# Altium schematic sheet PWM.SchDoc
size A4; SheetNumber: 5; SheetTotal: 5
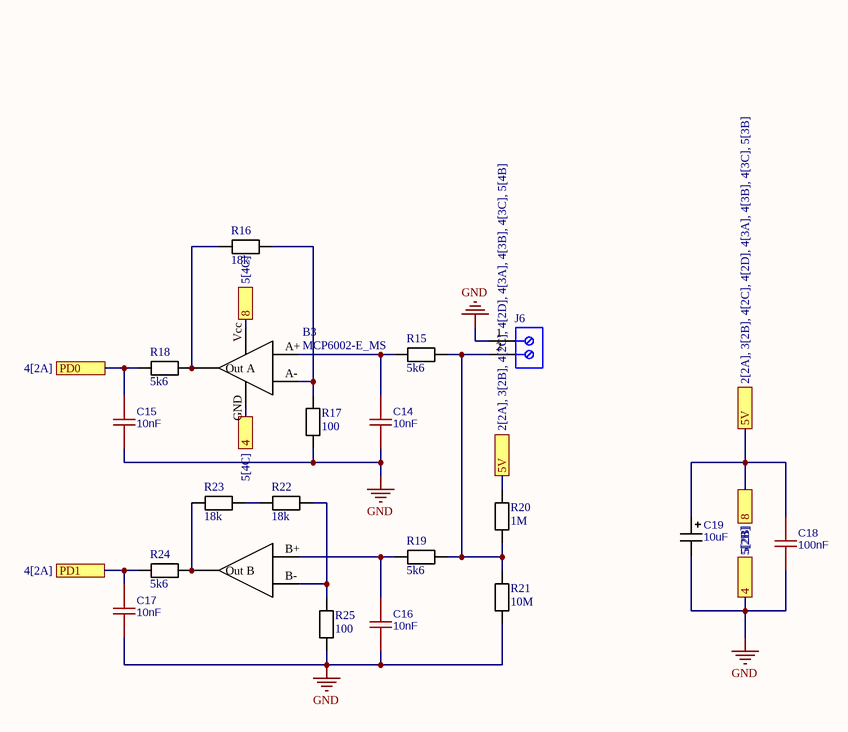
[diagram p0: PWM.SchDoc]

## Parts
B3  MCP6002-E_MS  [MCP6002-E_MS]
C14  10nF  [10nf]
C15  10nF  [10nf]
C16  10nF  [10nF]
C17  10nF  [10nF]
C18  100nF  [10nf]
C19  10uF  [10uf]
J6  691214110002  [2 Screw Terminal WE 691214110002]  (value not drawn)
R15  5k6  [R0805]
R16  18k  [R0805]
R17  100  [R0805]
R18  5k6  [R0805]
R19  5k6  [R0805]
R20  1M  [R0805]
R21  10M  [R0805]
R22  18k  [R0805]
R23  18k  [R0805]
R24  5k6  [R0805]
R25  100  [R0805]

## Ports
4 (see 5[2B]), 4 (see 5[4C]), 5V (see 2[2A], 3[2B], 4[2C], 4[2D], 4[3A], 4[3B], 4[3C], 5[3B]), 5V (see 2[2A], 3[2B], 4[2C], 4[2D], 4[3A], 4[3B], 4[3C], 5[4B]), 8 (see 5[2B]), 8 (see 5[4C]), PD0 (see 4[2A]), PD1 (see 4[2A])

## Nets
GND: B3.GND(VSS) C14.1 C15.1 C16.1 C17.1 C18.1 C19.2 J6.1 R17.1 R21.1 R25.1 ; port 4
5V: B3.Vcc(VDD) C18.2 C19.1 R20.2 ; port 8, port 5V
PD0: C15.2 R18.1 ; port PD0
PD1: C17.2 R24.1 ; port PD1
NetB3_7: B3.7(Out_B) R23.1 R24.2
NetB3_?1: B3.?1(Out_A) R16.1 R18.2
NetB3_A+: B3.A+(VINA+) C14.2 R15.1
NetB3_A-: B3.A-(VINA-) R16.2 R17.2
NetB3_B+: B3.B+(VINB+) C16.2 R19.1
NetB3_B-: B3.B-(VINB-) R22.2 R25.2
NetJ6_2: J6.2 R15.2 R19.2 R20.1 R21.2
NetR22_1: R22.1 R23.2

## Library data of the parts
B3 = MCP6002-E_MS: OP Amp Dual GP R-R I/O 6V; Manufacturer_Name: Microchip; Manufacturer_Part_Number: MCP6002-E/MS; Geometry.Height: 1.1mm; Mouser Part Number: 579-MCP6002-E/MS; Mouser Price/Stock: https://www.mouser.co.uk/ProductDetail/Microchip-Technology-Atmel/MCP6002-E-MS?qs=huzeVNXgovXv0kPjGdVLUA%3D%3D; Datasheet Link: https://datasheet.datasheetarchive.com/originals/distributors/Datasheets-304/55313.pdf
C14-C18 = 10nF: BOM_Manufacturer: CCTC(三环); BOM_Manufacturer Part: TCC0805X7R103M500DT; nameAlias: Capacitance; Contributor: LCSC; BOM_Supplier: LCSC; BOM_Supplier Part: C376921; BOM_JLCPCB Part Class: Extended Part; spicePre: C; spiceSymbolName: TCC0805X7R103M500DT
C19 = 10uF: BOM_Manufacturer: ST(先科); BOM_Manufacturer Part: CS1E100M-CRC54; nameAlias: Capacitance; Contributor: LCSC; BOM_Supplier: LCSC; BOM_Supplier Part: C98750; BOM_JLCPCB Part Class: Extended Part; spicePre: C; spiceSymbolName: CS1E100M-CRC54
J6 = 2 Screw Terminal WE 691214110002: Serie 2141 - 3.50 mm Horizontal Entry Modular with Rising Cage Clamp WR-TBL, 2 pin; Manufacturer: Wurth Elektronik; Pin Number: 2; Pitch: 3.50mm; Datasheet URL: http://katalog.we-online.de/em/datasheet/6912141100xx.pdf; Packaging: Box; Mounting Technology: THT; Package Reference: 691214110002; Manufacturer URL: http://www.we-online.de; Part Number: 691214110002; Publisher: WurthElektronik; Operating Temperature: -40to105degC
R15-R25 = Resistor: Manufacturer: Vishay Dale; Part Number: CRCW08050000Z0EA